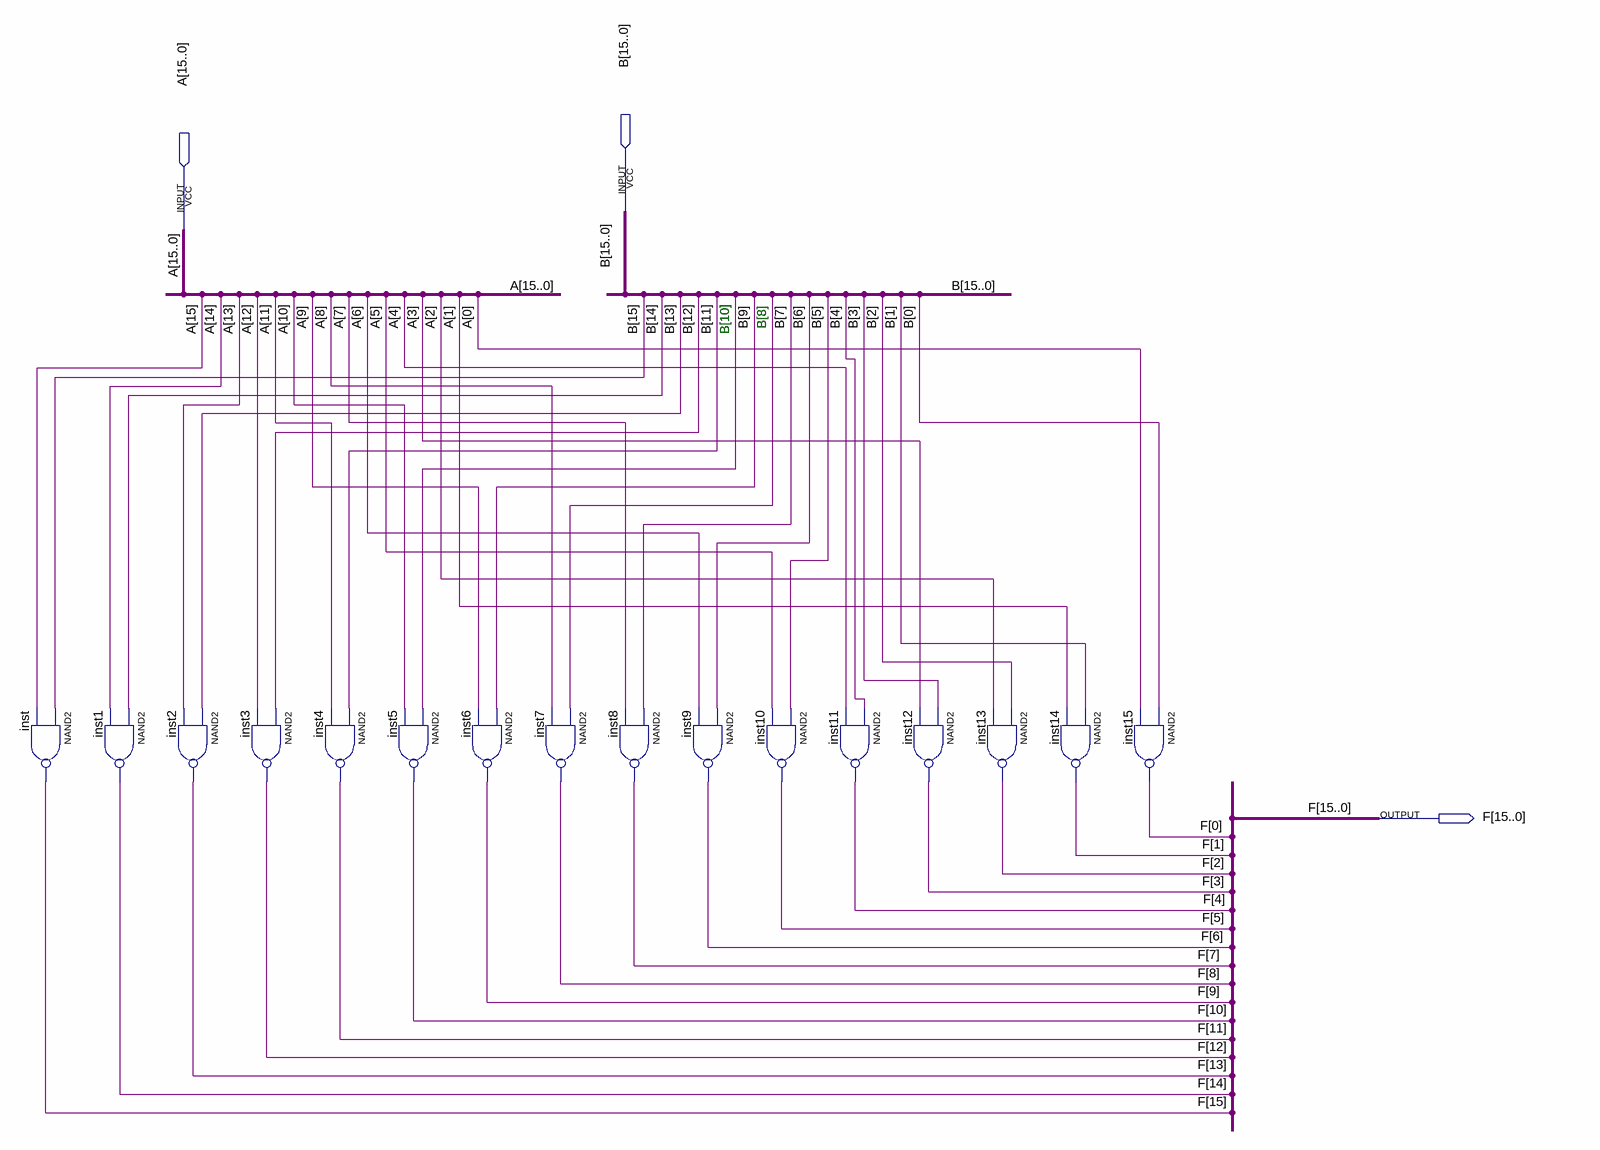
[diagram p0: schematic sheet]
// Quartus schematic NANDD.bdf as structural Verilog: 16 symbols, 3 pins
module NANDD (
  input  [15:0] B,
  input  [15:0] A,
  output [15:0] F
);

  nand inst (F[15], B[15], A[15]);
  nand inst1 (F[14], B[14], A[14]);
  nand inst2 (F[13], B[13], A[13]);
  nand inst3 (F[12], B[12], A[12]);
  nand inst4 (F[11], B[11], A[11]);
  nand inst5 (F[10], B[10], A[10]);
  nand inst6 (F[9], B[9], A[9]);
  nand inst7 (F[8], B[8], A[8]);
  nand inst8 (F[7], B[7], A[7]);
  nand inst9 (F[6], B[6], A[6]);
  nand inst10 (F[5], B[5], A[5]);
  nand inst11 (F[4], B[4], A[4]);
  nand inst12 (F[3], B[3], A[3]);
  nand inst13 (F[2], B[2], A[2]);
  nand inst14 (F[1], B[1], A[1]);
  nand inst15 (F[0], B[0], A[0]);

  // Notes on the sheet:
  //   B[10]
  //   B[8]
endmodule
